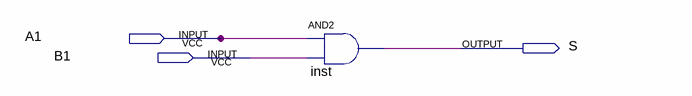
[diagram p0: schematic sheet]
// Quartus schematic TP1_block.bdf as structural Verilog: 1 symbols, 3 pins
module TP1_block (
  input  A1,
  input  B1,
  output S
);

  and inst (S, A1, B1);
endmodule
